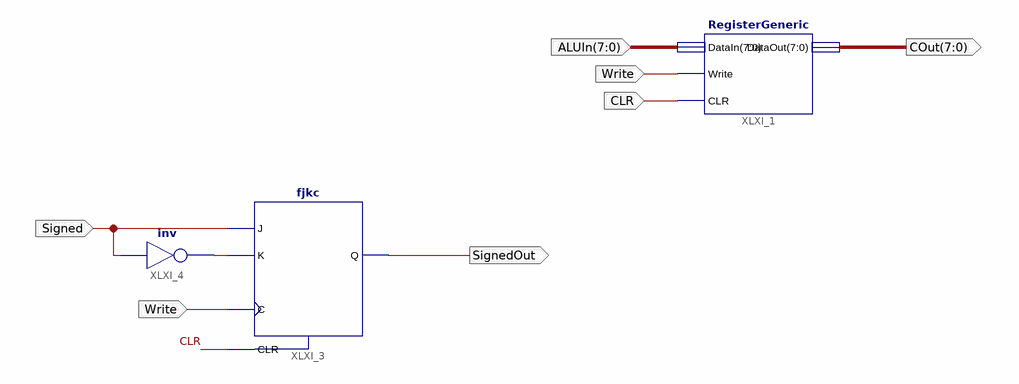
[diagram p0: schematic sheet 1]
// Xilinx ISE schematic RegisterC.sch (spartan3e) as structural Verilog: 3 symbols, 6 ports
module RegisterC (
  input  CLR,
  input  [7:0] ALUIn,
  input  Signed,
  input  Write,
  output [7:0] COut,
  output SignedOut
);

  wire XLXN_6;

  RegisterGeneric XLXI_1 (.DataIn(ALUIn), .Write(Write), .DataOut(COut), .CLR(CLR));
  fjkc XLXI_3 (.C(Write), .CLR(CLR), .J(Signed), .K(XLXN_6), .Q(SignedOut));
  not XLXI_4 (XLXN_6, Signed);
endmodule
